# EAGLE design network_analyzer (EAGLE 7.6.0)
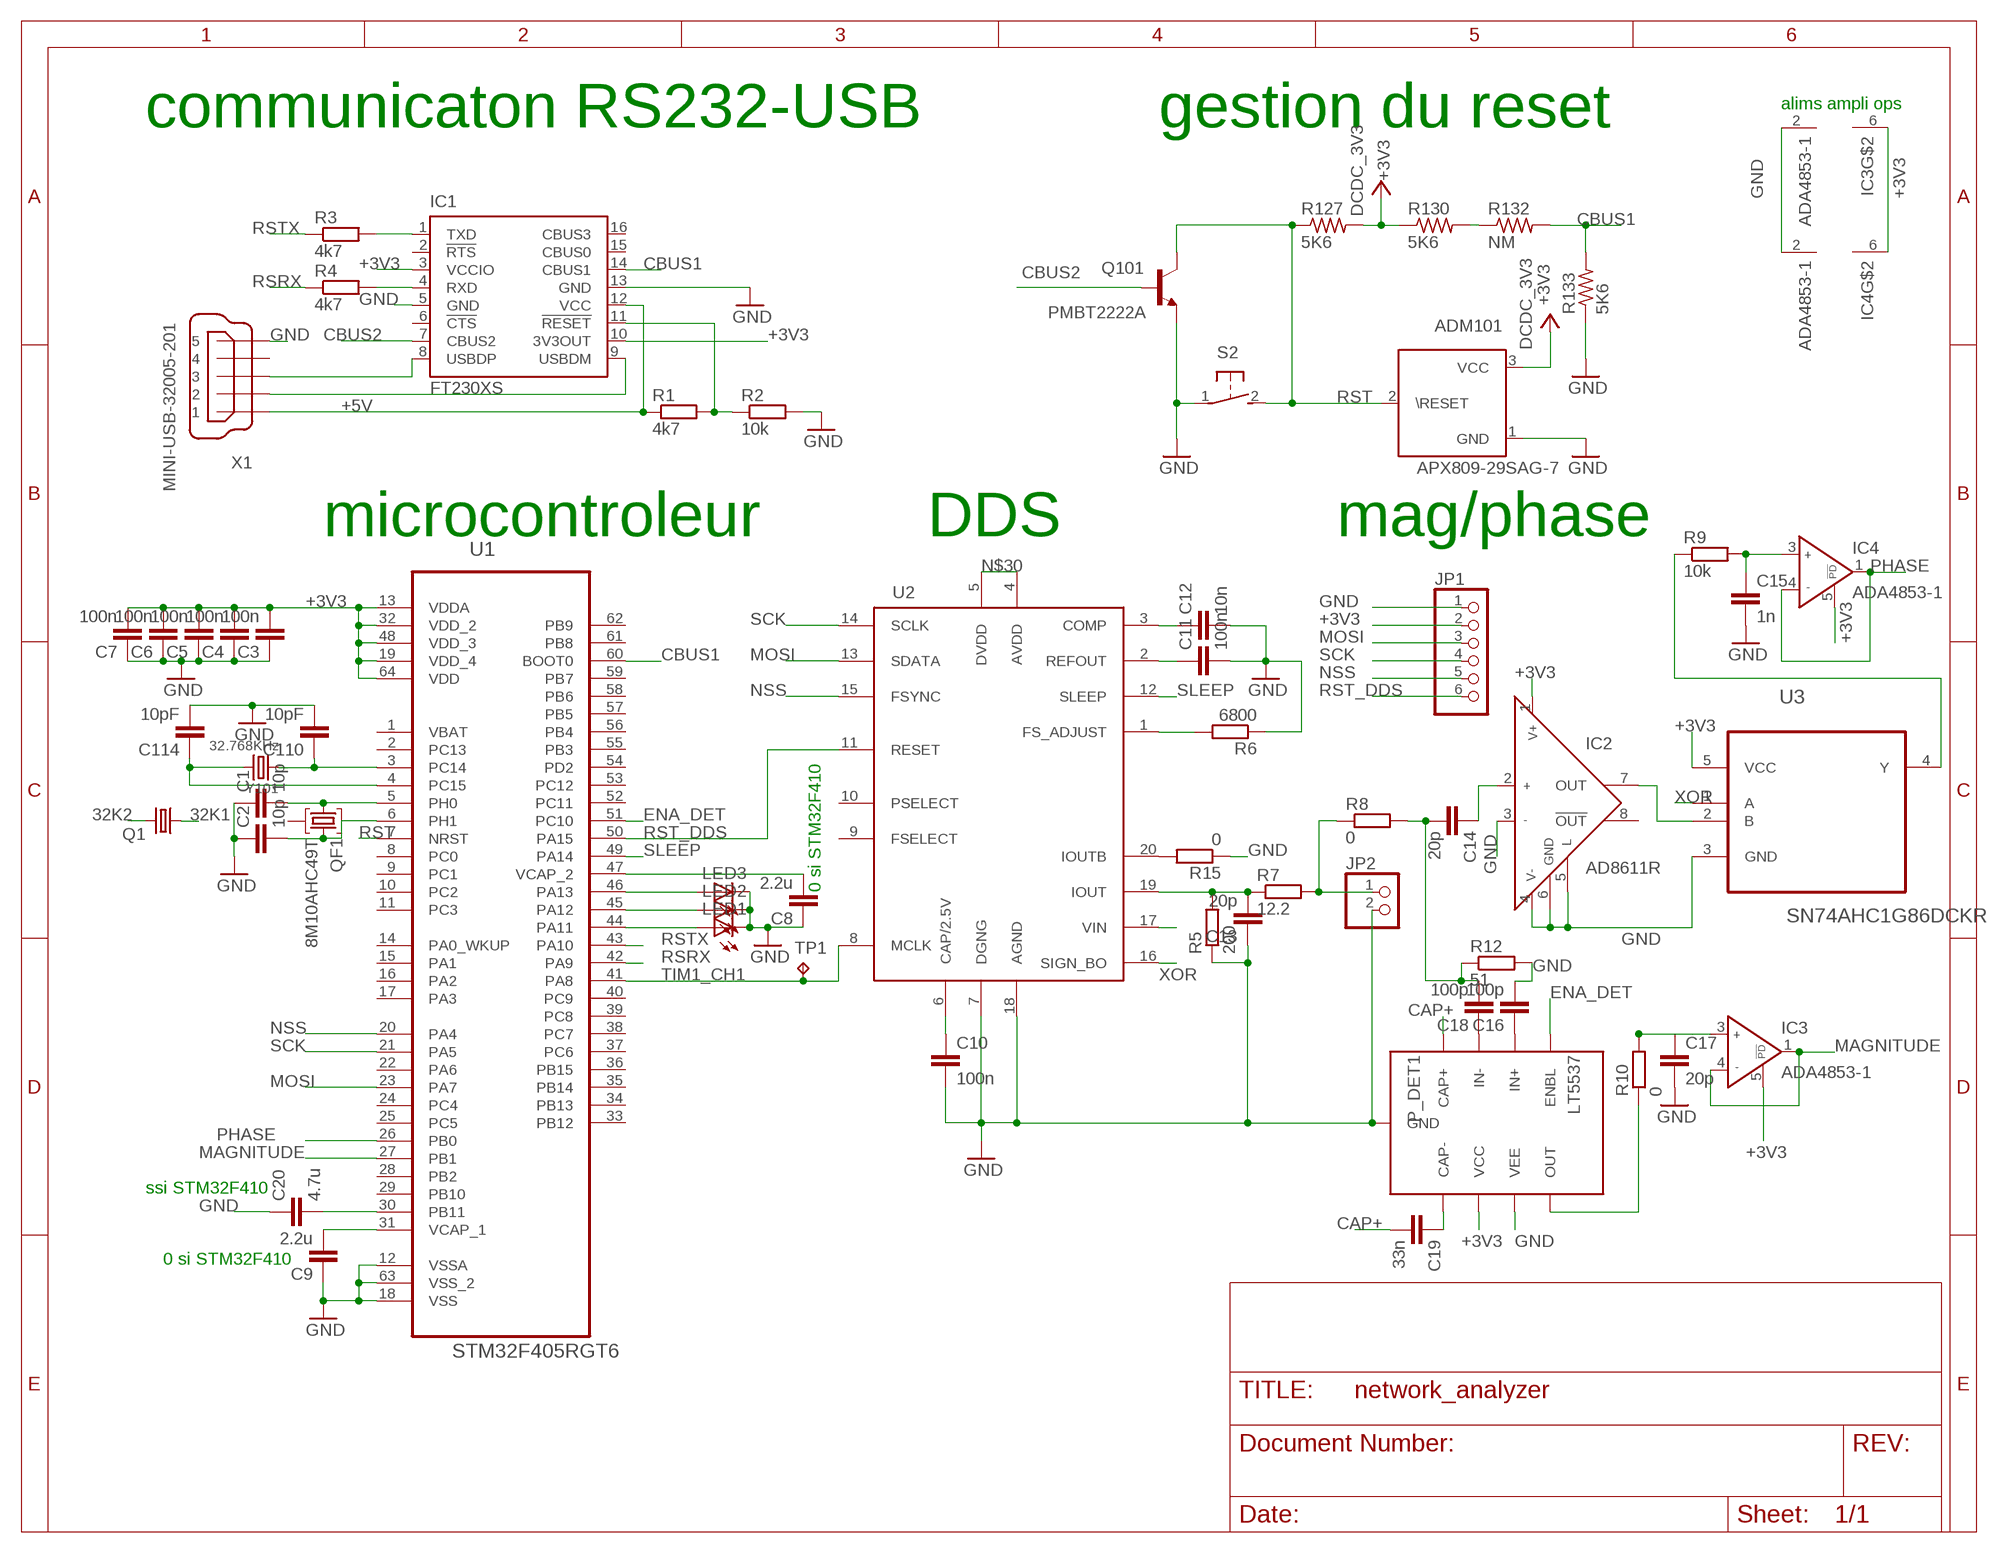
[diagram p0: schematic, sheet 1]

## Parts
ADM101  APX809-29SAG-7  [CIS_SOT23_01]
C1  10p  C-EUC0603  [C0603]
C2  10p  C-EUC0603  [C0603]
C3  100n  C-EUC0603  [C0603]
C4  100n  C-EUC0603  [C0603]
C5  100n  C-EUC0603  [C0603]
C6  100n  C-EUC0603  [C0603]
C7  100n  C-EUC0603  [C0603]
C8  2.2u  C-EUC0402  [C0402]
C9  2.2u  C-EUC0402  [C0402]
C10  100n  C-EUC0603  [C0603]
C11  100n  C-EUC0603  [C0603]
C12  10n  C-EUC0603  [C0603]
C13  20p  C-EUC0603  [C0603]
C14  20p  C-EUC0603  [C0603]
C15  1n  C-EUC0603  [C0603]
C16  100p  C-EUC0603  [C0603]
C17  20p  C-EUC0603  [C0603]
C18  100p  C-EUC0603  [C0603]
C19  33n  C-EUC0603  [C0603]
C20  4.7u  C-EUC0603  [C0603]
C110  10pF  GRM1555C1H100J  [C0402]
C114  10pF  GRM1555C1H100J  [C0402]
IC1  FT230XS  [SSOP16]
IC2  AD8611R  [SO8]
IC3  ADA4853-1  [SC70-6]
IC4  ADA4853-1  [SC70-6]
JP1  PINHD-1X6  [1X06]
JP2  PINHD-1X2  [1X02]
LED1  LEDSML0603  [SML0603]
LED2  LEDSML0603  [SML0603]
LED3  LEDSML0603  [SML0603]
P_DET1  LT5537  [3X2MMDFN]
Q1  CRYSTALTC26H  [TC26H]
Q101  PMBT2222A  [Q-S_SOT23_01]
QF1  8M10AHC49T  [HC49U]
R1  4k7  R-EU_R0603  [R0603]
R2  10k  R-EU_R0603  [R0603]
R3  4k7  R-EU_R0603  [R0603]
R4  4k7  R-EU_R0603  [R0603]
R5  200  R-EU_R0603  [R0603]
R6  6800  R-EU_R0603  [R0603]
R7  12.2  R-EU_0207/10  [0207/10]
R8  0  R-EU_R0603  [R0603]
R9  10k  R-EU_R0603  [R0603]
R10  0  R-EU_R0603  [R0603]
R12  51  R-EU_R0603  [R0603]
R15  0  R-EU_R0603  [R0603]
R127  5K6  ERJ-2GEJ562X  [R0402]
R130  5K6  ERJ-2GEJ562X  [R0402]
R132  NM  R0402-NM  [R0402]
R133  5K6  ERJ-2GEJ562X  [R0402]
S2  31-XX  [B3F-31XX]
TP1  TPB1,27  [B1,27]
U1  STM32F405RGT6  [QFP50P1200X1200X160-64N]
U2  AD9834  [TSSOP20]
U3  SN74AHC1G86DCKR  [SOT65P210X110-5N]
X1  MINI-USB-32005-201  [32005-201]
Y101  32.768KHz  NX3215SA  [Y-S_3215_01]

## Nets
32K1: C110.1 Q1.1 U1.3(PC14) Y101.1
32K2: C114.1 Q1.2 U1.4(PC15) Y101.2
+3V3: ADM101.3(VCC) C3.2 C4.2 C5.2 C6.2 C7.2 IC1.3(VCCIO) IC1.10(3V3OUT) IC2.1(V+) IC3.5(!POWERDOWN) IC3.6(V+) IC4.5(!POWERDOWN) IC4.6(V+) JP1.2 P_DET1.P$6(VCC) R127.2 R130.1 U1.13(VDDA) U1.19(VDD_4) U1.32(VDD_2) U1.48(VDD_3) U1.64(VDD) U3.5(VCC) ; supply symbol labelled DCDC_3V3
+5V: IC1.12(VCC) R1.1 X1.1
CAP+: C19.2 P_DET1.P$4(CAP+)
CBUS1: IC1.14(CBUS1) R132.2 R133.2 U1.60(BOOT0)
CBUS2: IC1.7(CBUS2) Q101.1(B)
COMP: C12.1 U2.3(COMP)
ENA_DET: P_DET1.P$1(ENBL) U1.51(PC10)
GND: ADM101.1(GND) C1.1 C2.1 C3.1 C4.1 C5.1 C6.1 C7.1 C8.1 C9.1 C10.2 C11.2 C12.2 C13.1 C15.2 C16.2 C17.2 C20.1 C110.2 C114.2 IC1.5(GND) IC1.13(GND) IC2.3(IN-) IC2.4(V-) IC2.5(L) IC2.6(GND) IC3.2(V-) IC4.2(V-) JP1.1 JP2.2 LED1.C LED2.C LED3.C P_DET1.P$7(VEE) P_DET1.P$9(GND) Q101.2(E) R2.2 R5.1 R6.1 R12.2 R15.1 R133.1 S2.1(P) U1.12(VSSA) U1.18(VSS) U1.63(VSS_2) U2.7(DGNG) U2.17(VIN) U2.18(AGND) U3.3(GND) X1.5
MAGNITUDE: IC3.1(OUT) IC3.4(IN-) U1.27(PB1)
MOSI: JP1.3 U1.23(PA7) U2.13(SDATA)
N$1: IC1.11(!RESET) R1.2 R2.1
N$2: IC1.8(USBDP) X1.3
N$3: IC1.9(USBDM) X1.2
N$4: C1.2 QF1.1 U1.5(PH0)
N$5: C2.2 QF1.3 U1.6(PH1)
N$6: IC1.4(RXD) R4.2
N$7: IC1.1(TXD) R3.2
N$8: C9.2 U1.31(VCAP_1)
N$9: C8.2 U1.47(VCAP_2)
N$10: C10.1 U2.6(CAP/2.5V)
N$11: C11.1 U2.2(REFOUT)
N$12: C13.2 R5.2 R7.1 U2.19(IOUT)
N$13: C15.1 IC4.3(IN+) R9.2
N$14: JP2.1 R7.2 R8.1
N$15: R6.2 U2.1(FS_ADJUST)
N$16: P_DET1.P$8(OUT) R10.1
N$17: C14.1 IC2.2(IN+)
N$18: R9.1 U3.4(Y)
N$19: C19.1 P_DET1.P$5(CAP-)
N$20: C17.1 IC3.3(IN+) R10.2
N$21: R15.2 U2.20(IOUTB)
N$22: C18.1 P_DET1.P$3(IN-)
N$23: C16.1 P_DET1.P$2(IN+)
N$24: C14.2 C18.2 R8.2 R12.1
N$26: LED1.A U1.44(PA11)
N$27: LED2.A U1.45(PA12)
N$28: LED3.A U1.46(PA13)
N$29: C20.2 U1.30(PB11)
N$30: U2.4(AVDD) U2.5(DVDD)
N$31: IC2.7(OUT) U3.2(B)
N$128: R130.2 R132.1
NSS: JP1.5 U1.20(PA4) U2.15(FSYNC)
PHASE: IC4.1(OUT) IC4.4(IN-) U1.26(PB0)
RSRX: R4.1 U1.42(PA9)
RST: ADM101.2(\RESET) Q101.3(C) R127.1 S2.2(S) U1.7(NRST)
RST_DDS: JP1.6 U1.50(PA15) U2.11(RESET)
RSTX: R3.1 U1.43(PA10)
SCK: JP1.4 U1.21(PA5) U2.14(SCLK)
SLEEP: U1.49(PA14) U2.12(SLEEP)
TIM1_CH1: TP1.TP U1.41(PA8) U2.8(MCLK)
XOR: U2.16(SIGN_BO) U3.1(A)
Unconnected: IC1.2(!RTS) IC1.6(!CTS) IC1.15(CBUS0) IC1.16(CBUS3) IC2.8(!OUT) QF1.2 U1.1(VBAT) U1.2(PC13) U1.8(PC0) U1.9(PC1) U1.10(PC2) U1.11(PC3) U1.14(PA0_WKUP) U1.15(PA1) U1.16(PA2) U1.17(PA3) U1.22(PA6) U1.24(PC4) U1.25(PC5) U1.28(PB2) U1.29(PB10) U1.33(PB12) U1.34(PB13) U1.35(PB14) U1.36(PB15) U1.37(PC6) U1.38(PC7) U1.39(PC8) U1.40(PC9) U1.52(PC11) U1.53(PC12) U1.54(PD2) U1.55(PB3) U1.56(PB4) U1.57(PB5) U1.58(PB6) U1.59(PB7) U1.61(PB8) U1.62(PB9) U2.9(FSELECT) U2.10(PSELECT) X1.4

## Notes on the sheet
- alims ampli ops
- communicaton RS232-USB | gestion du reset
- microcontroleur | DDS | mag/phase
- 0 si STM32F410
- ssi STM32F410
- 0 si STM32F410

## Library data of the parts
ADM101 = SparkFun-3-2-07:APX809-29SAG-7: Microprocessor Reset circuits SOT23; MANUFACTURER: DIODES INC; REFERENCE: APX809-29SAG-7; VENDOR: Farnell; VENDOR-PN: 1825364
C1-C20 = rcl:C-EU: CAPACITOR, European symbol
C110 C114 = capa:GRM1555C1H100J: capacitor 0402 COG 10pF 50V 5%; MANUFACTURER: MURATA; REFERENCE: GRM1555C1H100JZ01D; VENDOR: Farnell; VENDOR-PN: 8819564
IC1 = ftdichip:FT230X: USB to BASIC UART IC Auto generated by make-symbol-device-package-bsdl.ulp Rev. 43 Source: Data sheet <http://www.ftdichip.com/Support/Documents/DataSheets/ICs/DS_FT230X.pdf>
IC2 = analog-devices:AD8611: Ultrafast 4 ns Single Supply Comparators Source: http://www.analog.com/UploadedFiles/Data_Sheets/703465986AD8611_2_0.pdf Upgrade for LT1394 and LT1016 Designs; MPN: AD8611ARMZ-R2; OC_FARNELL: 1319472; OC_NEWARK: 19M8930
IC3 IC4 = analog-devices:ADA4853-1: Low Power, Rail-to-Rail Output, Video Op Amps with Ultralow Power Source: http://www.analog.com/static/imported-files/data_sheets/ADA4853-1_4853-2_4853-3.pdf; OC_FARNELL: unknown; OC_NEWARK: unknown
JP1 = pinhead:PINHD-1X6: PIN HEADER
JP2 = pinhead:PINHD-1X2: PIN HEADER
LED1-LED3 = led:LED: LED OSRAM: - CHIPLED LG R971, LG N971, LY N971, LG Q971, LY Q971, LO R971, LY R971 LH N974, LH R974 LS Q976, LO Q976, LY Q976 LO Q996 - Hyper CHIPLED LW Q18S LB Q993, LB Q99A, LB R99A - SideLED LS A670, LO A670, LY A670, LG A670, LP A670 LB A673, LV A673, LT A673, LW A673 LH A674 LY A675 LS A676, LA A676, LO A676, LY A676, LW A676 LS A679, LY A679, LG A679 - Hyper Micro SIDELED® LS Y876, LA Y876, LO Y876, LY Y876 LT Y87S - SmartLED LW L88C, LW L88S LB L89C, LB L89S, LG L890 LS L89K, LO L89K, LY L89K LS L896, LA L896, LO L896, LY L896 - TOPLED LS T670, LO T670, LY T670, LG T670, LP T670 LSG T670, LSP T670, LSY T670, LOP T670, LYG T670 LG T671, LOG T671, LSG T671 LB T673, LV T673, LT T673, LW T673 LH T674 LS T676, LA T676, LO T676, LY T676, LB T676, LH T676, LSB T676, LW T676 LB T67C, LV T67C, LT T67C, LS T67K, LO T67K, LY T67K, LW E67C LS E67B, LA E67B, LO E67B, LY E67B, LB E67C, LV E67C, LT E67C LW T67C LS T679, LY T679, LG T679 LS T770, LO T770, LY T770, LG T770, LP T770 LB T773, LV T773, LT T773, LW T773 LH T774 LS E675, LA E675, LY E675, LS T675 LS T776, LA T776, LO T776, LY T776, LB T776 LHGB T686 LT T68C, LB T68C - Hyper Mini TOPLED® LB M676 - Mini TOPLED Santana® LG M470 LS M47K, LO M47K, LY M47K Source: http://www.osram.convergy.de LUXEON: - LUMILED® LXK2-PW12-R00, LXK2-PW12-S00, LXK2-PW14-U00, LXK2-PW14-V00 LXK2-PM12-R00, LXK2-PM12-S00, LXK2-PM14-U00 LXK2-PE12-Q00, LXK2-PE12-R00, LXK2-PE12-S00, LXK2-PE14-T00, LXK2-PE14-U00 LXK2-PB12-K00, LXK2-PB12-L00, LXK2-PB12-M00, LXK2-PB14-N00, LXK2-PB14-P00, LXK2-PB14-Q00 LXK2-PR12-L00, LXK2-PR12-M00, LXK2-PR14-Q00, LXK2-PR14-R00 LXK2-PD12-Q00, LXK2-PD12-R00, LXK2-PD12-S00 LXK2-PH12-R00, LXK2-PH12-S00 LXK2-PL12-P00, LXK2-PL12-Q00, LXK2-PL12-R00 Source: www.luxeon.com KINGBRIGHT: KA-3528ASYC Source: www.kingbright.com
P_DET1 = lasser:LT5537: Linear LT5537 Log Detector Wide Dynamic Range: 83dB Near DC - 1000MHz operation
Q1 = crystal:CRYSTAL: CRYSTAL; OC_FARNELL: unknown; OC_NEWARK: unknown
Q101 = passif:PMBT2222A: NPN Switching Transistors cms SOT23; MANUFACTURER: NXP; REFERENCE: PMBT2222A; VENDOR: Farnell; VENDOR-PN: 1081475
QF1 = crystal:8M10AHC49T: Monolithic Crystal Filters Source: www.vanlong.com; OC_FARNELL: unknown; OC_NEWARK: unknown
R1-R10 R12 R15 = rcl:R-EU_: RESISTOR, European symbol
R127 R130 R133 = resistor:ERJ-2GEJ562X: Resistor 0402 serie ERJ 5K6 100mW 5%; MANUFACTURER: PANASONIC; REFERENCE: ERJ-2GEJ562X; VENDOR: farnell; VENDOR-PN: 2282622
R132 = resistor:R0402-NM: Resistor 0402 NM
S2 = switch-omron:31-XX: OMRON SWITCH; MPN: B3F-3100; OC_FARNELL: 959704; OC_NEWARK: 36M3582
TP1 = testpad:TP: Test pad
U1 = stm32f405:STM32F405RGT6: IC, MCU, 32BIT, 1MB FLASH, 64LQFP; MPN: STM32F405RGT6; OC_FARNELL: 2064363; OC_NEWARK: 73T2329; PACKAGE: 64LQFP; SUPPLIER: STMicroelectronics
U2 = ad9834:?AD9834: The AD9834 is a 75 MHz low power DDS device capable of producing high performance sine and triangular outputs. It also has an on-board comparator that allows a square wave to be produced for clock generation. Consuming only 20 mW of power at 3 V makes the AD9834 an ideal candidate for power-sensitive applications.
U3 = 74186:SN74AHC1G86DCKR: SINGLE 2-INPUT EXCLUSIVE-OR GATE; MPN: SN74AHC1G86DCKR; OC_FARNELL: 1287455; OC_NEWARK: 26M3231; PACKAGE: SC70-5; SUPPLIER: Texas Instruments
X1 = con-cypressindustries:MINI-USB-: MINI USB-B Conector Source: www.cypressindustries.com; OC_FARNELL: unknown; OC_NEWARK: unknown
Y101 = rf:NX3215SA: Cristal CMS 3.2x1.6mm 32.768KHz; MANUFACTURER: NDK; REFERENCE: NX3215SA

## Net classes
0 default: width 0.12 mm, drill 0.25 mm, clearance 0.12 mm

## Board
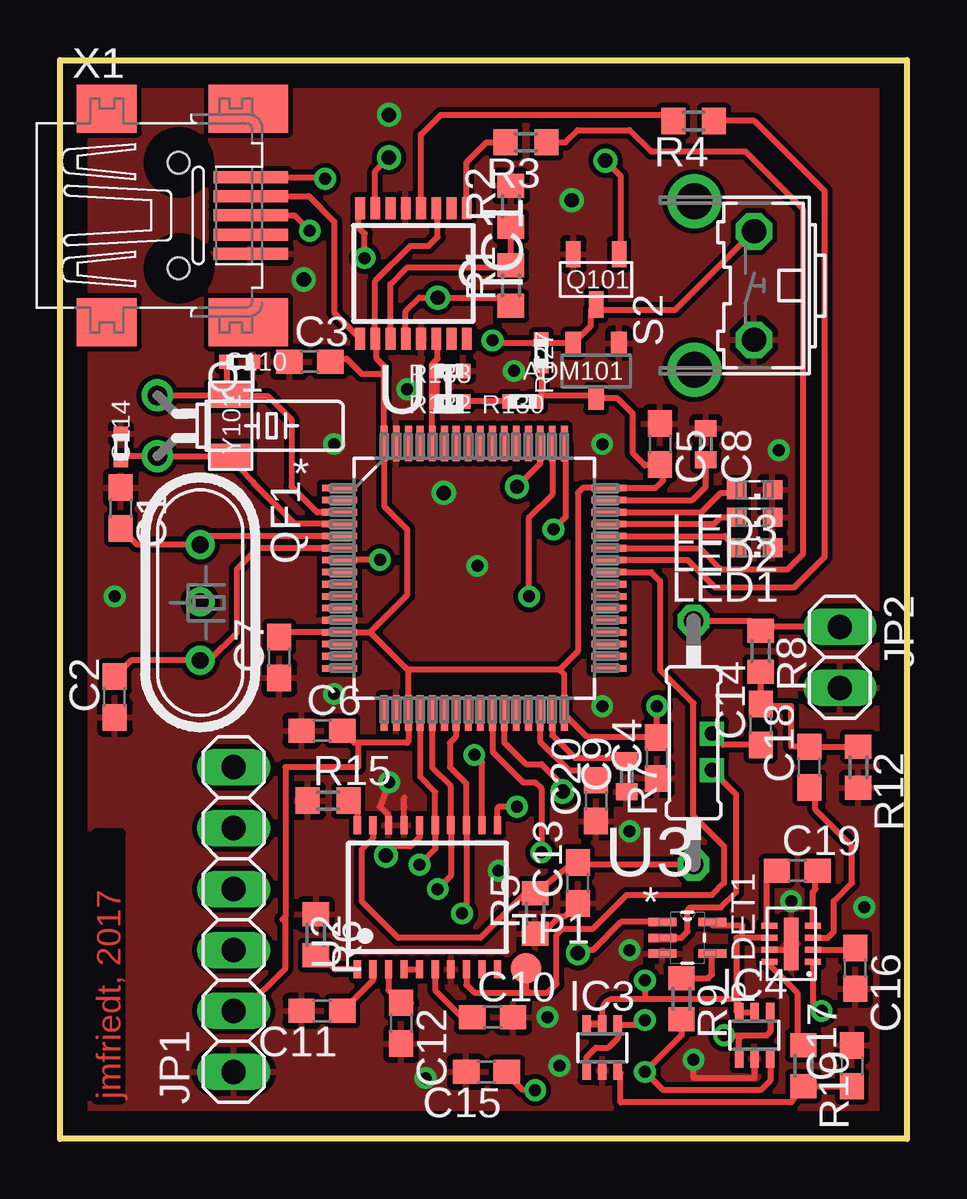
[diagram p1: board, top side]
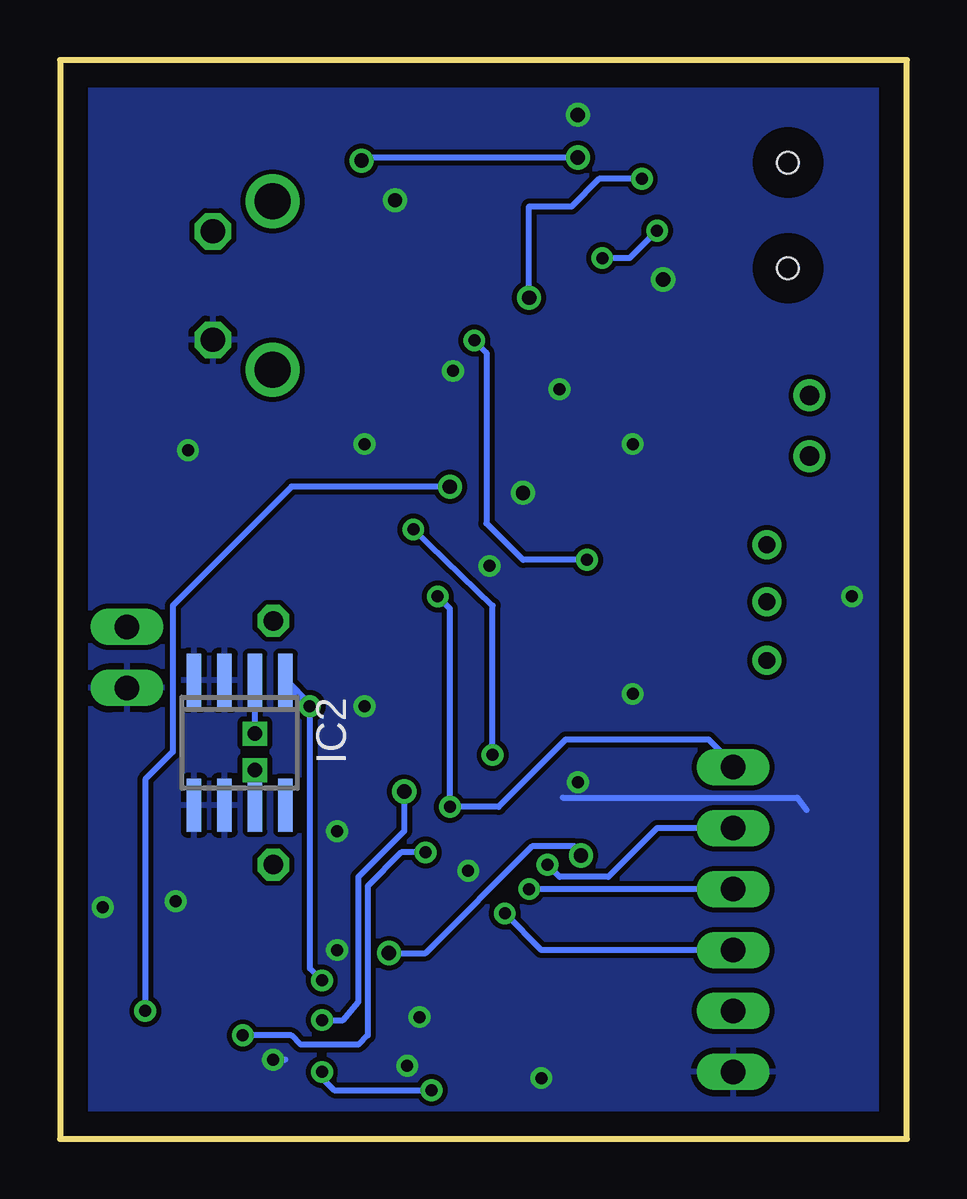
[diagram p2: board, bottom side, seen from below]

Size 35.31 x 44.96 mm. Coordinates in mm from the lower left corner, seen from the top.
Outline: 0,44.96 35.31,44.96 35.31,0 0,0 0,44.96
Copper layers (1*16): Top 0.035mm / dielectric 1.5mm / Bottom 0.035mm
Design rules "default": minimum track width 10mil, minimum drill 24mil, track to track 8mil, track to pad 8mil, pad to pad 8mil, via to via 8mil, smd to smd 8mil, copper to edge 40mil, drill to drill 8mil, minimum pad ring 10mil, minimum via ring 8mil, stop-mask expansion 4mil, vias tented up to drill 0mil, thermal gap 10mil

### Footprints (pad centres in the part's own frame; a part is rotated, then mirrored left to right if it is on the bottom)
CIS_SOT23_01 = smd 0.65 x 0.95: 1 -0.95,-1.15; 2 0.95,-1.15; 3 0,1.15
C0603 = smd 1.1 x 1: 1 -0.85,0; 2 0.85,0
C0402 = smd 0.7 x 0.9: 1 -0.65,0; 2 0.65,0
C0402' = smd 0.6 x 0.6: 1 -0.55,0; 2 0.55,0
SSOP16 = smd 0.914 x 0.406: 1 -2.718,2.223; 2 -2.718,1.587; 3 -2.718,0.953; 4 -2.718,0.318; 5 -2.718,-0.318; 6 -2.718,-0.953; 7 -2.718,-1.587; 8 -2.718,-2.223; 9 2.718,-2.223; 10 2.718,-1.587; 11 2.718,-0.953; 12 2.718,-0.318; 13 2.718,0.318; 14 2.718,0.953; 15 2.718,1.587; 16 2.718,2.223
SO8 = smd 0.6 x 2.2: 1 -1.905,-2.6; 2 -0.635,-2.6; 3 0.635,-2.6; 4 1.905,-2.6; 5 1.905,2.6; 6 0.635,2.6; 7 -0.635,2.6; 8 -1.905,2.6
SC70-6 = smd 0.35 x 0.8: 1 -0.65,-0.95; 2 0,-0.95; 3 0.65,-0.95; 4 0.65,0.95; 5 0,0.95; 6 -0.65,0.95
1X06 = drill 1.016 long: 1 -6.35,0; 2 -3.81,0; 3 -1.27,0; 4 1.27,0; 5 3.81,0; 6 6.35,0
1X02 = drill 1.016 long: 1 -1.27,0; 2 1.27,0
SML0603 = smd 0.8 x 0.8: A 0.75,0; C -0.75,0
3X2MMDFN = smd 0.25 x 0.675: P$1 -0.75,-0.91; P$2 -0.25,-0.91; P$3 0.25,-0.91; P$4 0.75,-0.91; P$5 0.75,0.91; P$6 0.25,0.91; P$7 -0.25,0.91; P$8 -0.75,0.91 | smd 2.2 x 0.61: P$9 0,0
TC26H = drill 0.813: 1 -1.27,0; 2 1.27,0
Q-S_SOT23_01 = smd 0.6 x 1.1: 1 -0.953,-1.05; 2 0.953,-1.05; 3 0,1.05
HC49U = drill 0.7 pad 1.2: 1 -2.413,0; 2 -0.027,0; 3 2.413,0
R0603 = smd 1 x 1.1: 1 -0.85,0; 2 0.85,0
0207/10 = drill 0.813 octagon: 1 -5.08,0; 2 5.08,0
R0402 = smd 0.6 x 0.6: 1 -0.55,0; 2 0.55,0
B3F-31XX = drill 1.016 octagon: 1 -2.261,-1.245; 2 2.261,-1.245 | drill 1.499 pad 2.159: 3 -3.505,1.245; 4 3.505,1.245
B1,27 = smd 1.27 x 1.27: TP 0,0
QFP50P1200X1200X160-64N = smd 1.473 x 0.279: 1 -5.613,3.759; 2 -5.613,3.251; 3 -5.613,2.743; 4 -5.613,2.261; 5 -5.613,1.753; 6 -5.613,1.245; 7 -5.613,0.762; 8 -5.613,0.254; 9 -5.613,-0.254; 10 -5.613,-0.762; 11 -5.613,-1.245; 12 -5.613,-1.753; 13 -5.613,-2.261; 14 -5.613,-2.743; 15 -5.613,-3.251; 16 -5.613,-3.759; 33 5.613,-3.759; 34 5.613,-3.251; 35 5.613,-2.743; 36 5.613,-2.261; 37 5.613,-1.753; 38 5.613,-1.245; 39 5.613,-0.762; 40 5.613,-0.254; 41 5.613,0.254; 42 5.613,0.762; 43 5.613,1.245; 44 5.613,1.753; 45 5.613,2.261; 46 5.613,2.743; 47 5.613,3.251; 48 5.613,3.759 | smd 0.279 x 1.473: 17 -3.759,-5.613; 18 -3.251,-5.613; 19 -2.743,-5.613; 20 -2.261,-5.613; 21 -1.753,-5.613; 22 -1.245,-5.613; 23 -0.762,-5.613; 24 -0.254,-5.613; 25 0.254,-5.613; 26 0.762,-5.613; 27 1.245,-5.613; 28 1.753,-5.613; 29 2.261,-5.613; 30 2.743,-5.613; 31 3.251,-5.613; 32 3.759,-5.613; 49 3.759,5.613; 50 3.251,5.613; 51 2.743,5.613; 52 2.261,5.613; 53 1.753,5.613; 54 1.245,5.613; 55 0.762,5.613; 56 0.254,5.613; 57 -0.254,5.613; 58 -0.762,5.613; 59 -1.245,5.613; 60 -1.753,5.613; 61 -2.261,5.613; 62 -2.743,5.613; 63 -3.251,5.613; 64 -3.759,5.613
TSSOP20 = smd 0.3 x 0.75: 1 -3.1,-3.095; 2 -2.45,-3.095; 3 -1.8,-3.095; 4 -1.15,-3.095; 5 -0.5,-3.095; 6 0.15,-3.095; 7 0.8,-3.095; 8 1.45,-3.095; 9 2.1,-3.095; 10 2.75,-3.095; 11 2.75,2.905; 12 2.1,2.905; 13 1.45,2.905; 14 0.8,2.905; 15 0.15,2.905; 16 -0.5,2.905; 17 -1.15,2.905; 18 -1.8,2.905; 19 -2.45,2.905; 20 -3.1,2.905
SOT65P210X110-5N = smd 1.168 x 0.356: 1 -1.041,0.66; 2 -1.041,0; 3 -1.041,-0.66; 4 1.041,-0.66; 5 1.041,0.66
32005-201 = smd 3.1 x 0.5: 1 3,1.6; 2 3,0.8; 3 3,0; 4 3,-0.8; 5 3,-1.6 | smd 2.5 x 2: M1 -3,-4.45; M2 -3,4.45 | smd 3.3 x 2: M3 2.9,4.45; M4 2.9,-4.45 | hole 0.9: 0,2.2; 0,-2.2
Y-S_3215_01 = smd 1 x 1.8: 1 -1.25,0; 2 1.25,0

### Placement (x,y rotation side)
ADM101  22.35,32 180 top
C1  2.54,26.29 270 top
C2  2.29,18.41 90 top
C3  10.41,32.38 0 top
C4  24.89,15.88 90 top
C5  25.02,28.96 270 top
C6  10.92,17.02 0 top
C7  9.14,20.07 90 top
C8  26.92,28.96 270 top
C9  23.62,15.11 90 top
C10  18.03,5.08 0 top
C11  10.92,5.33 180 top
C12  14.22,4.83 270 top
C13  21.59,10.67 90 top
C14  29.21,17.27 90 top
C15  17.78,2.79 180 top
C16  33.15,7.11 270 top
C17  33.02,3.05 90 top
C18  31.24,15.49 90 top
C19  30.73,11.18 0 top
C20  22.35,14.1 90 top
C110  10pF  [C0402']  7.49,32.38 0 top
C114  10pF  [C0402']  2.54,28.83 90 top
IC1  14.73,36.07 270 top
IC2  27.81,16.51 180 bottom
IC3  22.61,3.81 0 top
IC4  28.96,4.32 0 top
JP1  7.24,9.14 90 top
JP2  32.51,20.07 270 top
LED1  28.96,24.64 180 top
LED2  28.96,25.91 180 top
LED3  28.96,27.05 180 top
P_DET1  30.48,8.13 90 top
Q1  4.06,29.72 270 top
Q101  22.35,35.81 180 top
QF1  5.84,22.35 270 top
R1  18.8,35.56 90 top
R2  18.8,38.86 90 top
R3  19.43,41.53 180 top
R4  26.42,42.42 180 top
R5  19.81,9.4 90 top
R6  10.67,8.51 270 top
R7  26.42,16.51 90 top
R8  29.21,20.32 270 top
R9  25.91,5.84 270 top
R10  30.99,3.05 270 top
R12  33.27,15.49 270 top
R15  11.18,14.1 0 top
R127  20.07,32.77 270 top
R130  19.3,30.73 180 top
R132  16.26,30.73 180 top
R133  16.26,32 180 top
S2  27.69,35.56 90 top
TP1  19.43,7.11 0 top
U1  17.27,23.37 0 top
U2  15.49,10.16 0 top
U3  26.16,8.38 0 top
X1  4.95,38.48 0 top
Y101  7.11,29.72 270 top

### Tracks (layer width: path | path; a pad name or v marks a point on that pad's centre or on a via)
32K1
  Top 0.254: U1.3 10.72,26.11 9.65,27.18 9.65,29.97 8.66,30.97 Y101.1 | Q1.1 7.09,30.99 Y101.1 | C110.1 6.94,31.14 Y101.1
32K2
  Top 0.254: U1.4 9.78,25.63 8.06,27.35 8.06,27.37 7.49,27.94 7.49,28.09 Y101.2 7.09,28.45 Q1.2 2.71,28.45 C114.1
+3V3  (via drill 0.5)
  Top 0.254: 13.51,31.88 U1.64 13.51,26.36 14.48,25.4 14.48,22.66 12.93,21.11 | 13.51,31.88 13.51,32.21 13.21,32.51 13.21,33.29 IC1.10 13.14,35.75 14.61,37.21 15.37,37.21 15.75,37.59 15.75,38.72 IC1.3 | C7.2 9.34,21.11 U1.13 12.93,21.11 | 25.15,27.43 C5.2 | 12.93,21.11 14.53,19.51 | 14.53,19.51 U1.19 14.53,16.56 14.48,16.51 12.45,16.51 | 20.83,19.56 21.03,19.36 U1.32 21.03,17.7 21.97,16.76 24.85,16.76 C4.2 | 20.83,19.56 14.58,19.56 14.53,19.51 | 20.83,19.56 21.59,20.32 21.59,26.92 21.79,27.13 U1.48 24.84,27.13 25.15,27.43 | 9.4,9.27 9.4,7.11 7.62,5.33 JP1.2 | U3.5 27.2,8.89 28.45,8.89 28.45,8.38 P_DET1.P$6 28.19,8.38 28.19,5.33 28.31,5.33 IC4.6 | 28.24,5.33 IC4.6 | IC4.5 IC4.6 | IC3.5 IC3.6 21.96,4.83 22.61,4.83 22.61,5.33 arc-90 23.11,5.84 24.38,5.84 | 24.38,5.84 28.24,5.84 IC4.6 | C4.2 24.8,16.6 | v24.38,6.6 24.38,5.84 | C3.2 11.94,32.51 12.57,31.88 13.51,31.88 | 9.4,9.27 9.4,15.49 12.45,15.49 12.45,16.51 | 12.45,16.51 12.28,16.51 C6.2 | 9.27,9.14 9.4,9.27 | R127.2 20.07,30.99 | 20.07,30.99 19.81,30.78 R130.1 19.97,30.85 | 25.15,27.43 25.15,27.94 25.02,28.07 24.38,28.07 23.88,28.57 23.88,30.23 23.24,30.86 22.36,30.86 ADM101.3 22.22,30.99 20.07,30.99 | C4.2 v24.89,18.03
  Bottom 0.254: v24.89,18.03 24.89,7.11 v24.38,6.6
  Bottom 0.406: IC2.1 25.97,19.11 v24.89,18.03
+5V  (via drill 0.5, 0.6)
  Top 0.254: 7.04,40.21 X1.1 10.97,40.08 v11.05,40.01 | R1.1 18.84,35.05 v15.75,35.05 14.99,35.05 14.41,34.48 IC1.12
  Bottom 0.254: v11.05,40.01 12.83,40.01 13.97,38.86 15.75,38.86 v15.75,35.05
CAP+
  Top 0.254: P_DET1.P$4 31.39,10.31 31.5,10.41 31.5,11.09 C19.2
CBUS1
  Top 0.254: U1.60 15.52,32 | 15.52,32 15.52,32.28 15.75,32.51 15.75,33.29 IC1.14 | R132.2 R133.2 15.52,32
CBUS2  (via drill 0.6)
  Top 0.254: IC1.7 13.14,40.32 v13.72,40.89 | Q101.1 23.37,36.93 23.37,40.13 v22.73,40.77
  Bottom 0.254: v13.72,40.89 22.61,40.89 v22.73,40.77
COMP
  Top 0.254: U2.3 13.69,6.21 C12.1 14.64,5.68
ENA_DET  (via drill 0.5, 0.6)
  Top 0.254: P_DET1.P$1 31.39,5.69 v31.75,5.33 | U1.51 20.02,28.14 v19.05,27.18
  Bottom 0.254: v31.75,5.33 31.75,14.99 30.61,16.13 30.61,22.23 25.65,27.18 v19.05,27.18
GND  (via drill 0.5, 0.6)
  Top 0.254: P_DET1.P$7 30.23,7.88 P_DET1.P$9 | IC4.2 28.96,2.54 26.42,2.54 v26.42,3.3 | v13.72,14.86 13.34,13.84 13.69,13.48 U2.18 | R5.1 20.11,8.55 20.83,9.27 21.04,9.27 C13.1 | U2.17 14.34,13.84 14.35,14.22
  Bottom 0.254: v26.42,3.3 25.91,3.3 | 4.19,13.72 4.57,14.22 14.35,14.22
  other vias: 16,26.92 22.61,28.96 11.43,28.96 21.34,39.12 29.97,28.7 22.61,18.03 11.43,18.54 2.29,22.61 14.48,31.24 18.92,32 18.29,11.18 20.32,5.08 15.24,2.54 33.53,9.65 30.48,9.91 20.83,3.05 23.75,7.87 10.16,35.81 17.4,23.88 13.72,42.67 23.75,12.83
  pour Bottom: -0.76,45.72 34.29,45.72 34.29,1.27 -0.76,1.27
  pour Top: -0.76,45.72 34.29,45.72 34.29,1.27 -0.76,1.27
MAGNITUDE  (via drill 0.5, 0.6)
  Top 0.254: IC3.1 21.96,3.41 22.35,3.81 22.86,3.81 23.26,4.21 IC3.4 24.32,4.76 v24.38,4.95 | U1.27 18.52,16.54 19.43,15.62 20.07,15.62 20.95,14.73 v20.95,14.48
  Bottom 0.254: v20.95,14.48 20.95,12.83 22.86,10.92 22.86,5.71 23.5,4.95 v24.38,4.95
MOSI  (via drill 0.5)
  Top 0.254: v16.76,9.4 16.94,9.58 U2.13 16.94,14.81 16.26,15.49 16.26,16.51 16.51,16.76 U1.23
  Bottom 0.254: JP1.3 15.24,7.87 v16.76,9.4
N$1
  Top 0.254: IC1.11 13.78,35.62 14.48,36.32 18.71,36.32 R1.2 R2.1
N$2  (via drill 0.5)
  Top 0.254: 12.45,38.85 IC1.8 12.45,38.72 12.45,37.97 12.7,37.72 v12.7,36.7 | X1.3 9.78,38.48 v10.41,37.85
  Bottom 0.254: v10.41,37.85 11.56,36.7 v12.7,36.7
N$3
  Top 0.254: X1.2 10.38,39.28 11.43,38.23 11.43,34.43 IC1.9
N$4
  Top 0.254: U1.5 6.2,25.12 QF1.1 3.21,24.77 C1.2
N$5
  Top 0.254: U1.6 8.23,24.61 7.37,23.75 7.37,21.08 6.22,19.94 QF1.3 2.96,19.94 C2.2
N$6
  Top 0.254: IC1.4 15.05,41.85 15.88,42.67 25.31,42.67 R4.2
N$7
  Top 0.254: IC1.1 16.95,40.7 17.78,41.53 R3.2
N$8
  Top 0.254: U1.31 20.52,16.82 21.46,15.88 23.38,15.88 C9.2
N$9
  Top 0.254: U1.47 26.36,26.62 26.92,27.18 C8.2
N$10
  Top 0.254: U2.6 15.64,6.2 16.76,5.08 C10.1
N$11
  Top 0.254: U2.2 13.04,6.61 C11.1
N$12
  Top 0.254: R7.1 21.76,11.43 C13.2 21.08,11.26 R5.2 19.39,10.25 17.53,8.38 14.1,8.38 12.57,9.91 12.57,12.06 13.04,12.54 U2.19
N$13  (via drill 0.5)
  Top 0.254: C15.1 18.88,2.45 19.3,2.03 v19.81,2.03 | IC4.3 29.61,2.43 29.21,2.03 25.15,2.03 v24.38,2.79 25.91,4.32 R9.2
  Bottom 0.254: v24.38,2.79 24.38,2.54 23.88,2.03 v19.81,2.03
N$14
  Top 0.254: 29.21,21.34 R8.1 | R7.2 28.79,21.59 R8.1 | JP2.1 29.38,21.34 R8.1
N$15
  Top 0.254: U2.1 11.48,7.07 10.67,7.87 R6.2
N$16
  Top 0.254: P_DET1.P$8 29.57,7.26 30.73,6.1 30.73,4.32 31.11,3.94 | 31.11,3.94 31.24,3.81 | R10.1 31.08,3.9 31.11,3.94
N$17  (via drill 0.6)
  Top 0.254: C14.1 27.65,16.42 v27.18,16.89
  Bottom 0.254: v27.18,16.89 IC2.2
N$18
  Top 0.254: R9.1 27.01,6.69 27.18,6.86 27.18,7.7 U3.4
N$19
  Top 0.254: P_DET1.P$5 29.46,8.88 29.46,10.76 C19.1
N$20
  Top 0.254: C17.1 R10.2 30.9,2.2 30.48,1.52 23.37,1.52 23.37,2.75 IC3.3
N$21
  Top 0.254: R15.2 12.39,13.73 U2.20
N$22
  Top 0.254: P_DET1.P$3 32,8.38 32.26,8.64 32.26,9.91 33.02,10.67 33.02,12.19 31.5,13.72 31.5,14.39 C18.1
N$23
  Top 0.254: P_DET1.P$2 32.85,7.88 C16.1
N$24
  Top 0.254: R8.2 C14.2 29.21,18.03 30.48,18.03 30.48,16.34 C18.2 R12.1
N$26
  Top 0.254: U1.44 27.72,25.12 LED1.A
N$27
  Top 0.254: U1.45 27.28,25.63 27.56,25.91 LED2.A
N$28
  Top 0.254: U1.46 26.75,26.11 27.56,26.92 28.08,26.92 LED3.A
N$29
  Top 0.254: U1.30 20.02,16.56 21.21,15.37 21.68,15.37 C20.2
N$30
  Top 0.254: U2.4 U2.5
N$31  (via drill 0.6)
  Top 0.254: U3.2 25.91,8.38 26.16,8.64 26.16,9.53 26.29,9.65 27.56,9.65 28.19,10.29 28.19,14.35 v27.18,15.37
  Bottom 0.254: v27.18,15.37 IC2.7
N$128
  Top 0.254: R130.2 R132.1
NSS  (via drill 0.5)
  Top 0.254: U1.20 15.01,15.09 15.64,14.46 U2.15 15.64,12.09 v14.99,11.43
  Bottom 0.254: JP1.5 10.41,12.95 12.45,10.92 14.48,10.92 v14.99,11.43
PHASE  (via drill 0.5)
  Top 0.254: U1.26 18.03,16.13 19.3,14.86 19.81,14.86 20.07,14.61 v20.07,11.94 | 28.45,4.32 28.31,4.18 IC4.1 28.24,3.3 | 28.45,4.32 29.46,4.32 29.61,4.46 IC4.4 | v27.69,4.32 28.45,4.32
  Bottom 0.254: v27.69,4.32 25.65,4.32 25.27,3.94 22.86,3.94 22.48,4.32 22.48,10.54 21.08,11.94 v20.07,11.94
RSRX
  Top 0.254: U1.42 26.16,24.13 27.3,22.99 30.61,22.99 31.88,24.26 31.88,39.5 28.96,42.42 R4.1
RST  (via drill 0.5)
  Top 0.254: 19.72,33.15 ADM101.2 22.13,33.88 22.13,34.32 | 19.72,33.15 R127.1 20.11,33.32 | Q101.3 22.13,34.54 22.13,34.32 | 22.13,34.32 22.35,34.54 25.65,34.54 S2.2 | 19.72,33.15 18.15,33.15 v18.03,33.27 | v13.34,24.13 U1.7
  Bottom 0.254: v13.34,24.13 16,24.13 17.53,25.65 17.53,32.77 v18.03,33.27
RST_DDS  (via drill 0.5)
  Top 0.254: U2.11 18.24,13.8 18.29,13.84 v19.05,13.84 | v19.56,22.61 19.56,25.91 20.52,26.87 U1.50
  Bottom 0.254: v19.56,22.61 19.05,22.1 v19.05,13.84 17.02,13.84 14.22,16.64 8.26,16.64 7.24,15.62 JP1.6
RSTX
  Top 0.254: 24.78,24.61 U1.43 26.7,24.61 27.56,23.75 30.35,23.75 30.99,24.38 30.99,38.73 28.57,41.15 24.64,41.15 23.75,42.04 21.59,42.04 21.08,41.53 R3.1
SCK  (via drill 0.5)
  Top 0.254: U1.21 15.52,15.47 16.29,14.69 U2.14 16.29,10.96 v15.75,10.41
  Bottom 0.254: JP1.4 v15.75,10.41
SLEEP  (via drill 0.5)
  Top 0.254: U2.12 17.59,15.68 v17.27,16 | U1.49 21.08,28.93 21.08,25.91 v20.57,25.4
  Bottom 0.254: v17.27,16 17.27,22.23 v20.57,25.4
TIM1_CH1
  Top 0.254: U2.8 16.94,6.42 17.27,6.1 19.43,6.1 | 19.43,6.1 19.56,6.1 | 19.56,6.1 19.43,6.22 TP1.TP 19.43,6.1 | U1.41 24.64,23.62 25.02,23.24 25.02,19.56 26.42,18.16 26.42,13.46 27.69,12.19 27.69,10.67 27.18,10.16 23.62,10.16 22.23,8.76 20.95,8.76 20.7,8.51 20.7,6.48 20.32,6.1 19.56,6.1
XOR  (via drill 0.6)
  Top 0.254: U3.1 23.39,9.04 22.23,7.87 21.59,7.87 v21.59,7.75 | U2.16 14.99,12.58 14.61,12.19 13.84,12.19 13.59,11.94 v13.59,11.81
  Bottom 0.254: v21.59,7.75 20.07,7.75 15.62,12.19 13.84,12.19 13.84,12.06 v13.59,11.81

### Text on the board
Top: jmfriedt, 2017